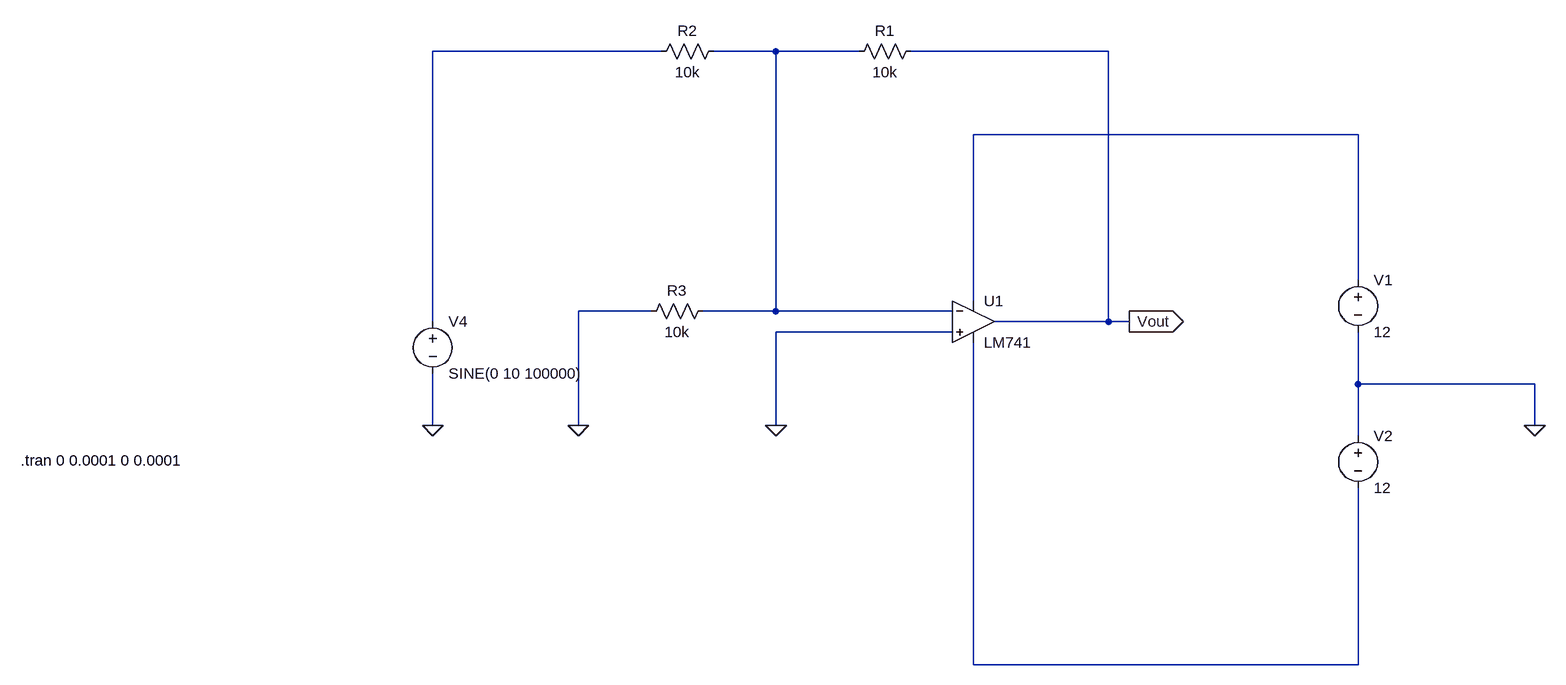
[diagram p0: schematic AnotherOne.asc]
AnotherOne.asc, the LTspice schematic file:
Version 4
SHEET 1 1076 680
WIRE -288 -288 -640 -288
WIRE -112 -288 -208 -288
WIRE 16 -288 -112 -288
WIRE 400 -288 96 -288
WIRE 784 -160 192 -160
WIRE 784 64 784 -160
WIRE 192 96 192 -160
WIRE -304 112 -416 112
WIRE -112 112 -112 -288
WIRE -112 112 -224 112
WIRE 160 112 -112 112
WIRE -640 128 -640 -288
WIRE 400 128 400 -288
WIRE 400 128 224 128
WIRE 432 128 400 128
WIRE 160 144 -112 144
WIRE 784 224 784 144
WIRE 1056 224 784 224
WIRE -640 288 -640 208
WIRE -416 288 -416 112
WIRE -112 288 -112 144
WIRE 1056 288 1056 224
WIRE 784 304 784 224
WIRE 192 656 192 160
WIRE 784 656 784 384
WIRE 784 656 192 656
FLAG 1056 288 0
FLAG 432 128 Vout
IOPIN 432 128 Out
FLAG -640 288 0
FLAG -416 288 0
FLAG -112 288 0
SYMBOL OpAmps\\LM741 192 64 R0
SYMATTR InstName U1
SYMBOL voltage 784 48 R0
WINDOW 123 0 0 Left 0
WINDOW 39 0 0 Left 0
SYMATTR InstName V1
SYMATTR Value 12
SYMBOL voltage 784 288 R0
WINDOW 123 0 0 Left 0
WINDOW 39 0 0 Left 0
SYMATTR InstName V2
SYMATTR Value 12
SYMBOL res 112 -304 R90
WINDOW 0 0 56 VBottom 2
WINDOW 3 32 56 VTop 2
SYMATTR InstName R1
SYMATTR Value 10k
SYMBOL res -192 -304 R90
WINDOW 0 0 56 VBottom 2
WINDOW 3 32 56 VTop 2
SYMATTR InstName R2
SYMATTR Value 10k
SYMBOL res -208 96 R90
WINDOW 0 0 56 VBottom 2
WINDOW 3 32 56 VTop 2
SYMATTR InstName R3
SYMATTR Value 10k
SYMBOL voltage -640 112 R0
WINDOW 123 0 0 Left 0
WINDOW 39 0 0 Left 0
SYMATTR InstName V4
SYMATTR Value SINE(0 10 100000)
TEXT -1274 342 Left 2 !.tran 0 0.0001 0 0.0001

The netlist it stands for:
* AnotherOne.asc
XU1 0 N002 N003 N004 Vout LM741  ; pins In+ In- V+ V- OUT
V1 N003 0 12
V2 0 N004 12
R1 Vout N002 10k
R2 N002 N001 10k
R3 N002 0 10k
V4 N001 0 SINE(0 10 100000)
.tran 0 0.0001 0 0.0001
.lib LM741.lib
.backanno
.end